# Altium schematic sheet LDO3v3.SchDoc
size 193 x 146 mm; DocumentNumber: 9; SheetNumber: 9; SheetTotal: 11
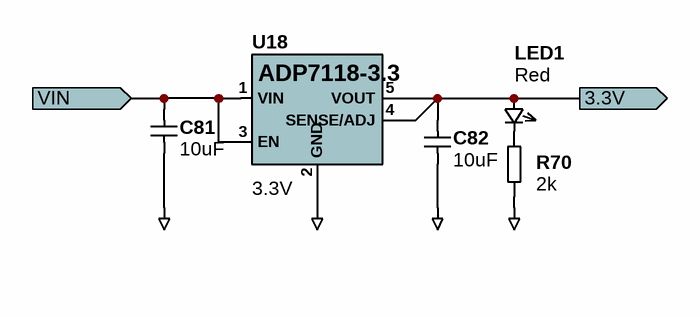
[diagram p0: LDO3v3.SchDoc]

## Parts
C81  10uF  [1206-capacitor]
C82  10uF  [1206-capacitor]
LED1  Red  [LED0603]
R70  2k  [0402-RESISTOR]
U18  3.3V  [SOT-23-5]

## Ports
3.3V (out), VIN (in)

## Nets
GND: C81.2 C82.2 R70.1 U18.2(GND)
3.3V: C82.1 LED1.A U18.4(SENSE/ADJ) U18.5(VOUT) ; port 3.3V
VIN: C81.1 U18.1(VIN) U18.3(EN) ; port VIN
NetLED1_K: LED1.K R70.2

## Notes on the sheet
- Title
- Project
- Drawing no.
- Date
- Drawn by
- Checked by
- Revision

## Library data of the parts
C81 C82 = C_1206: Capacitor 1206; Voltage Rating: 16V; Tolerance: ±20%; Dielectric: X7R/C0G; Value: 10uF; Case: 1206
LED1 = LED0603: Color: Red; Case: 0603
R70 = R_0402: Resistor 0402; Tolerance: ±1%; Value: 2k; Case: 0402
U18 = ADP7118-3.3: 20 V, 200 mA, Low Noise, / CMOS LDO Linear Regulator; HelpURL: https://www.analog.com/media/en/technical-documentation/data-sheets/adp7118.pdf; Case: TSOT-23-5; Supplier 1: Digi-Key; Supplier Part Number 1: ADP7118AUJZ-3.3-R7CT-ND; Value: 3.3V